# EAGLE design followLineSensor (EAGLE 7.7.0)
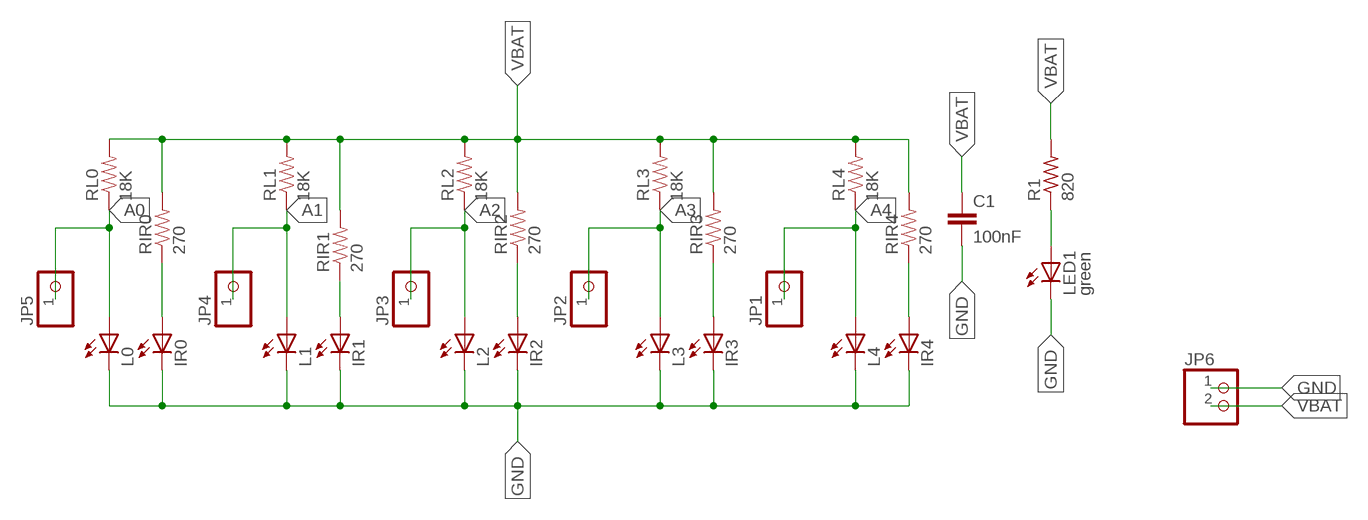
[diagram p0: schematic, sheet 1]

## Parts
C1  100nF  C-EUC0805  [C0805]
IR0  LED5MM  [LED5MM]
IR1  LED5MM  [LED5MM]
IR2  LED5MM  [LED5MM]
IR3  LED5MM  [LED5MM]
IR4  LED5MM  [LED5MM]
JP1  PINHD-1X1  [1X01]
JP2  PINHD-1X1  [1X01]
JP3  PINHD-1X1  [1X01]
JP4  PINHD-1X1  [1X01]
JP5  PINHD-1X1  [1X01]
JP6  PINHD-1X2  [1X02]
L0  LED5MM  [LED5MM]
L1  LED5MM  [LED5MM]
L2  LED5MM  [LED5MM]
L3  LED5MM  [LED5MM]
L4  LED5MM  [LED5MM]
LED1  green  LEDSML0805  [SML0805]
R1  820  R-US_R0805  [R0805]
RIR0  270  RESISTOR1206  [1206]
RIR1  270  RESISTOR1206  [1206]
RIR2  270  RESISTOR1206  [1206]
RIR3  270  RESISTOR1206  [1206]
RIR4  270  RESISTOR1206  [1206]
RL0  18K  RESISTOR1206  [1206]
RL1  18K  RESISTOR1206  [1206]
RL2  18K  RESISTOR1206  [1206]
RL3  18K  RESISTOR1206  [1206]
RL4  18K  RESISTOR1206  [1206]

## Nets
A0: JP5.1 L0.A RL0.1
A1: JP4.1 L1.A RL1.1
A2: JP3.1 L2.A RL2.1
A3: JP2.1 L3.A RL3.1
A4: JP1.1 L4.A RL4.1
GND: C1.2 IR0.K(C) IR1.K(C) IR2.K(C) IR3.K(C) IR4.K(C) JP6.1 L0.K(C) L1.K(C) L2.K(C) L3.K(C) L4.K(C) LED1.C
N$2: LED1.A R1.1
N$17: IR4.A RIR4.1
N$18: IR3.A RIR3.1
N$19: IR2.A RIR2.1
N$20: IR1.A RIR1.1
N$21: IR0.A RIR0.1
VBAT: C1.1 JP6.2 R1.2 RIR0.2 RIR1.2 RIR2.2 RIR3.2 RIR4.2 RL0.2 RL1.2 RL2.2 RL3.2 RL4.2

## Library data of the parts
C1 = rcl:C-EU: CAPACITOR, European symbol
IR0 IR1-IR4 L0 L1-L4 LED1 = led:LED: LED OSRAM: - CHIPLED LG R971, LG N971, LY N971, LG Q971, LY Q971, LO R971, LY R971 LH N974, LH R974 LS Q976, LO Q976, LY Q976 LO Q996 - Hyper CHIPLED LW Q18S LB Q993, LB Q99A, LB R99A - SideLED LS A670, LO A670, LY A670, LG A670, LP A670 LB A673, LV A673, LT A673, LW A673 LH A674 LY A675 LS A676, LA A676, LO A676, LY A676, LW A676 LS A679, LY A679, LG A679 - Hyper Micro SIDELED® LS Y876, LA Y876, LO Y876, LY Y876 LT Y87S - SmartLED LW L88C, LW L88S LB L89C, LB L89S, LG L890 LS L89K, LO L89K, LY L89K LS L896, LA L896, LO L896, LY L896 - TOPLED LS T670, LO T670, LY T670, LG T670, LP T670 LSG T670, LSP T670, LSY T670, LOP T670, LYG T670 LG T671, LOG T671, LSG T671 LB T673, LV T673, LT T673, LW T673 LH T674 LS T676, LA T676, LO T676, LY T676, LB T676, LH T676, LSB T676, LW T676 LB T67C, LV T67C, LT T67C, LS T67K, LO T67K, LY T67K, LW E67C LS E67B, LA E67B, LO E67B, LY E67B, LB E67C, LV E67C, LT E67C LW T67C LS T679, LY T679, LG T679 LS T770, LO T770, LY T770, LG T770, LP T770 LB T773, LV T773, LT T773, LW T773 LH T774 LS E675, LA E675, LY E675, LS T675 LS T776, LA T776, LO T776, LY T776, LB T776 LHGB T686 LT T68C, LB T68C - Hyper Mini TOPLED® LB M676 - Mini TOPLED Santana® LG M470 LS M47K, LO M47K, LY M47K Source: http://www.osram.convergy.de LUXEON: - LUMILED® LXK2-PW12-R00, LXK2-PW12-S00, LXK2-PW14-U00, LXK2-PW14-V00 LXK2-PM12-R00, LXK2-PM12-S00, LXK2-PM14-U00 LXK2-PE12-Q00, LXK2-PE12-R00, LXK2-PE12-S00, LXK2-PE14-T00, LXK2-PE14-U00 LXK2-PB12-K00, LXK2-PB12-L00, LXK2-PB12-M00, LXK2-PB14-N00, LXK2-PB14-P00, LXK2-PB14-Q00 LXK2-PR12-L00, LXK2-PR12-M00, LXK2-PR14-Q00, LXK2-PR14-R00 LXK2-PD12-Q00, LXK2-PD12-R00, LXK2-PD12-S00 LXK2-PH12-R00, LXK2-PH12-S00 LXK2-PL12-P00, LXK2-PL12-Q00, LXK2-PL12-R00 Source: www.luxeon.com KINGBRIGHT: KA-3528ASYC Source: www.kingbright.com
JP1-JP5 = pinhead:PINHD-1X1: PIN HEADER
JP6 = pinhead:PINHD-1X2: PIN HEADER
R1 = rcl:R-US_: RESISTOR, American symbol
RIR0 RIR1-RIR4 RL0 RL1-RL4 = SparkFun-Passives:RESISTOR: Resistor Basic schematic elements and footprints for 0603, 1206, and PTH resistors.

## Board
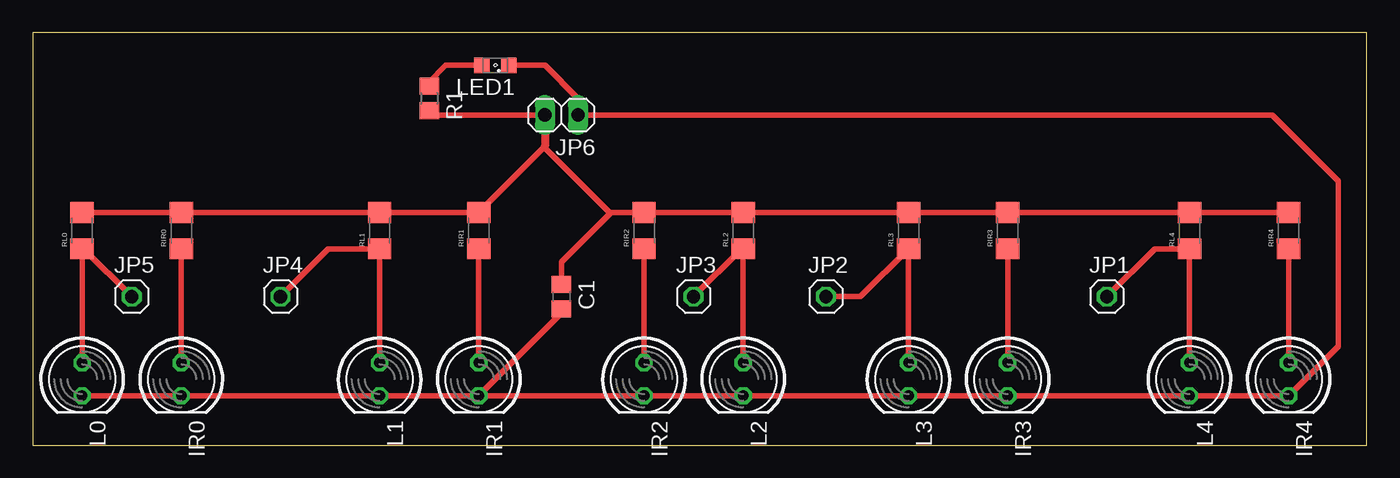
[diagram p1: board, top side]

Size 102.54 x 31.74 mm. Coordinates in mm from the lower left corner, seen from the top.
Outline: 0,0 102.54,0 102.54,31.74 0,31.74 0,0
Copper layers (1*16): Top 0.035mm / dielectric 1.5mm / Bottom 0.035mm
Design rules "default *": minimum track width 0.4mm, minimum drill 24mil, track to track 8mil, track to pad 8mil, pad to pad 8mil, via to via 8mil, smd to smd 8mil, copper to edge 40mil, drill to drill 8mil, minimum pad ring 10mil, minimum via ring 8mil, stop-mask expansion 4mil, vias tented up to drill 0mil, thermal gap 10mil

### Footprints (pad centres in the part's own frame; a part is rotated, then mirrored left to right if it is on the bottom)
C0805 = smd 1.3 x 1.5: 1 -0.95,0; 2 0.95,0
LED5MM = drill 0.813 octagon: A -1.27,0; K 1.27,0
1X01 = drill 1.016 octagon: 1 0,0
1X02 = drill 1.016 long: 1 -1.27,0; 2 1.27,0
SML0805 = smd 1.2 x 1.2: A 1.05,0; C -1.05,0
R0805 = smd 1.3 x 1.5: 1 -0.95,0; 2 0.95,0
1206 = smd 1.6 x 1.8: 1 -1.4,0; 2 1.4,0

### Placement (x,y rotation side)
C1  40.64,11.43 270 top
IR0  11.43,5.08 270 top
IR1  34.29,5.08 270 top
IR2  46.99,5.08 270 top
IR3  74.93,5.08 270 top
IR4  96.52,5.08 270 top
JP1  82.55,11.43 0 top
JP2  60.96,11.43 0 top
JP3  50.8,11.43 0 top
JP4  19.05,11.43 0 top
JP5  7.62,11.43 0 top
JP6  40.64,25.4 180 top
L0  3.81,5.08 270 top
L1  26.67,5.08 270 top
L2  54.61,5.08 270 top
L3  67.31,5.08 270 top
L4  88.9,5.08 270 top
LED1  35.56,29.21 180 top
R1  30.48,26.67 270 top
RIR0  11.43,16.51 90 top
RIR1  34.29,16.51 90 top
RIR2  46.99,16.51 90 top
RIR3  74.93,16.51 90 top
RIR4  96.52,16.51 90 top
RL0  3.81,16.51 90 top
RL1  26.67,16.51 90 top
RL2  54.61,16.51 90 top
RL3  67.31,16.51 90 top
RL4  88.9,16.51 90 top

### Tracks (layer width: path | path; a pad name or v marks a point on that pad's centre or on a via)
A0
  Top 0.406: L0.A RL0.1 3.94,15.11 JP5.1
A1
  Top 0.406: L1.A RL1.1 22.73,15.11 JP4.1
A2
  Top 0.406: L2.A RL2.1 54.48,15.11 JP3.1
A3
  Top 0.406: JP2.1 63.63,11.43 RL3.1 L3.A
A4
  Top 0.406: L4.A RL4.1 86.23,15.11 JP1.1
GND
  Top 0.406: LED1.C 39.37,29.21 41.91,26.67 JP6.1 95.25,25.4 100.33,20.32 100.33,7.62 IR4.K L4.K IR3.K L3.K L2.K IR2.K IR1.K | L0.K IR0.K L1.K IR1.K | C1.2 40.64,10.16 IR1.K
N$2
  Top 0.406: R1.1 30.48,27.94 31.75,29.21 LED1.A
N$17
  Top 0.406: IR4.A RIR4.1
N$18
  Top 0.406: IR3.A RIR3.1
N$19
  Top 0.406: RIR2.1 IR2.A
N$20
  Top 0.406: RIR1.1 IR1.A
N$21
  Top 0.406: RIR0.1 IR0.A
VBAT
  Top 0.406: JP6.2 30.8,25.4 R1.2 | 39.37,22.99 39.3,22.93 | 39.3,22.93 RIR1.2 RL1.2 RIR0.2 RL0.2 | RIR4.2 RL4.2 RIR3.2 RL3.2 RL2.2 47.12,17.91 46.99,17.78 RIR2.2 44.45,17.91 | 44.45,17.91 44.32,17.91 39.3,22.93 | C1.1 40.64,14.1 44.45,17.91
  Top 0.61: JP6.2 39.37,22.99